# Altium project TTFT.PrjPCB
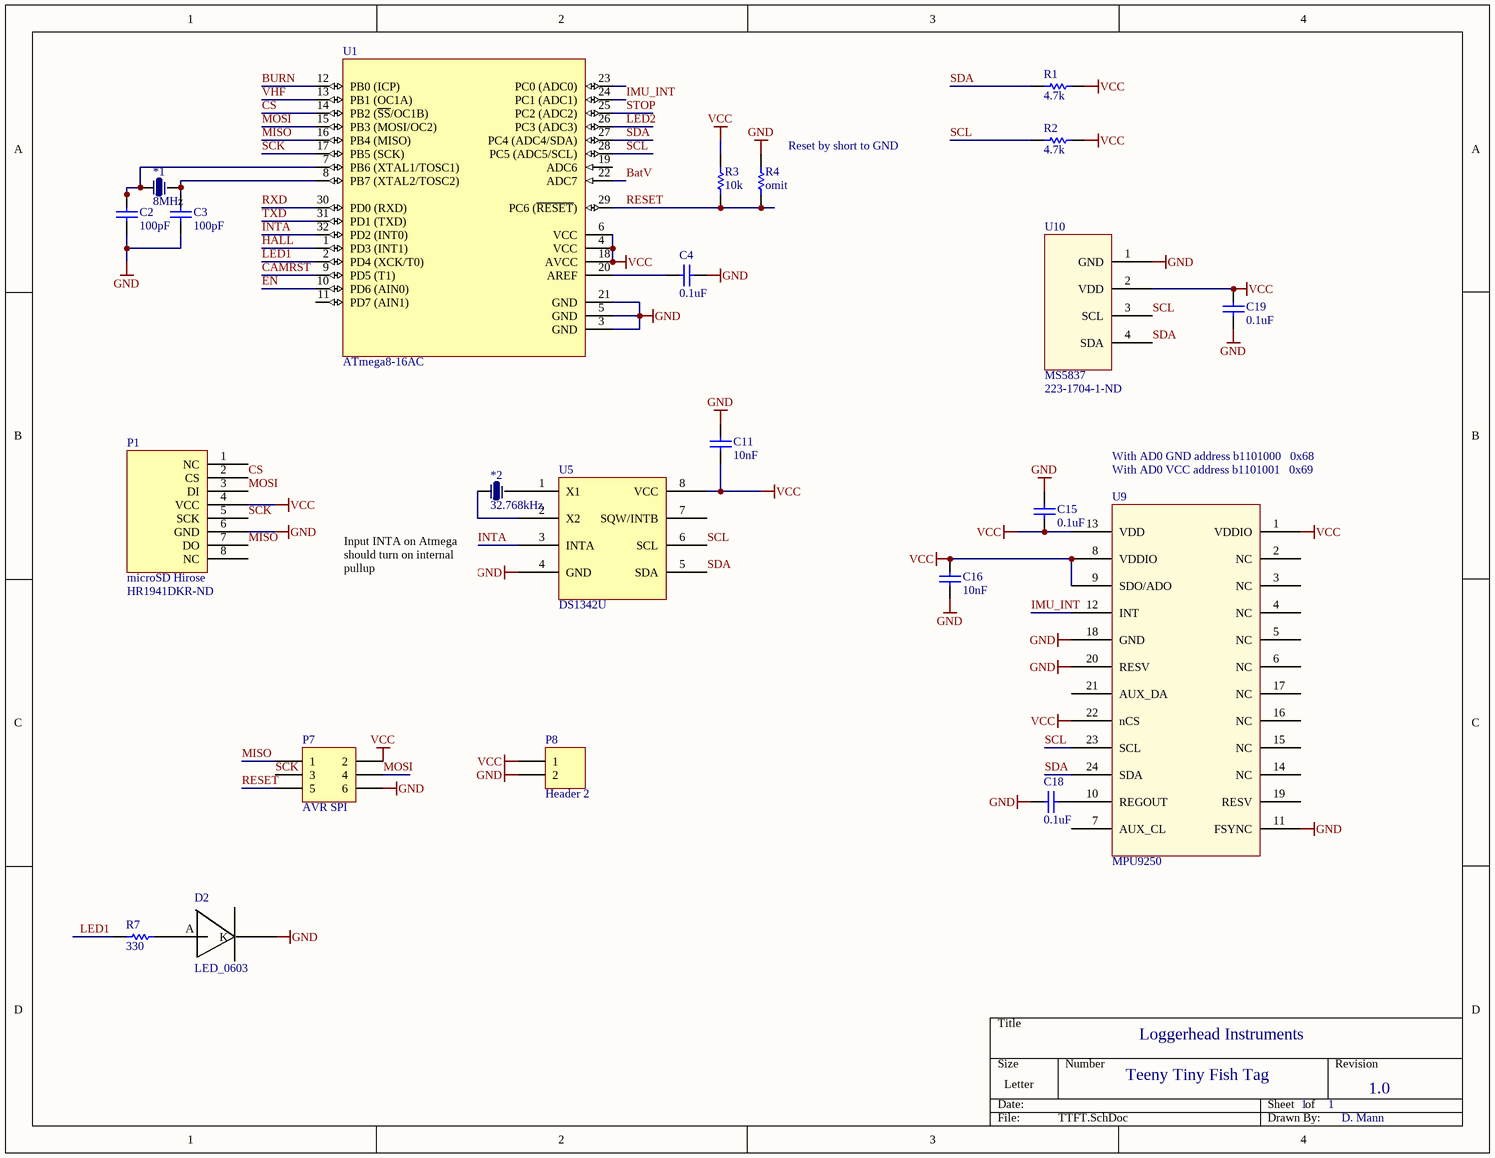
[diagram p0: TTFT.SchDoc]
1 sheet, 23 parts. Net scope: global (net labels, ports and power ports of the same name join across sheets).
Board file: TTFT.PcbDoc

## Sheet TTFT.SchDoc
size Letter

### Parts
*1  8MHz  [XTAL-ABM3]
*2  32.768kHz  [XTAL-ABS06]
C2  100pF  [0402]
C3  100pF  [0402]
C4  0.1uF  [0402]
C11  10nF  [0402]
C15  0.1uF  [0402]
C16  10nF  [0402]
C18  0.1uF  [0402]
C19  0.1uF  [0402]
D2  LED_0603  [Diode0603]
P1  microSD Hirose  Supplier Part Number 1: HR1941DKR-ND  [DM3D microSD]
P7  AVR SPI  [HDR2X3]
P8  Header 2  [HDR1X2]
R1  4.7k  [3-0603]
R2  4.7k  [3-0603]
R3  10k  [3-0603]
R4  omit  [3-0603]
R7  330  [3-0603]
U1  ATmega8-16AC  [32M1-A_M]
U5  DS1342U  [uSOP8]
U9  MPU9250  [MPU6500]
U10  MS5837  Supplier Part Number 1: 223-1704-1-ND  [MS5837]

### Nets
GND: C2.1 C3.1 C4.2 C11.1 C15.2 C16.2 C18.1 C19.1 D2.K P1.6(GND) P7.6 P8.2 R4.2 U1.3(GND) U1.5(GND) U1.21(GND) U5.4(GND) U9.11(FSYNC) U9.18(GND) U9.20(RESV) U10.1(GND)
VCC: C11.2 C15.1 C16.1 C19.2 P1.4(VCC) P7.2 P8.1 R1.2 R2.2 R3.2 U1.4(VCC) U1.6(VCC) U1.18(AVCC) U5.8(VCC) U9.1(VDDIO) U9.8(VDDIO) U9.9(SDO/ADO) U9.13(VDD) U9.22(nCS) U10.2(VDD)
BatV: U1.22(ADC7)
BURN: U1.12(PB0_(ICP))
CAMRST: U1.9(PD5_(T1))
CS: P1.2(CS) U1.14(PB2_(~{SS}/OC1B))
EN: U1.10(PD6_(AIN0))
HALL: U1.1(PD3_(INT1))
IMU_INT: U1.24(PC1_(ADC1)) U9.12(INT)
INTA: U1.32(PD2_(INT0)) U5.3(INTA)
LED1: R7.1 U1.2(PD4_(XCK/T0))
LED2: U1.26(PC3_(ADC3))
MISO: P1.7(DO) P7.1 U1.16(PB4_(MISO))
MOSI: P1.3(DI) P7.4 U1.15(PB3_(MOSI/OC2))
RESET: P7.5 R3.1 R4.1 U1.29(PC6_(~{RESET}))
RXD: U1.30(PD0_(RXD))
SCK: P1.5(SCK) P7.3 U1.17(PB5_(SCK))
SCL: R2.1 U1.28(PC5_(ADC5/SCL)) U5.6(SCL) U9.23(SCL) U10.3(SCL)
SDA: R1.1 U1.27(PC4_(ADC4/SDA)) U5.5(SDA) U9.24(SDA) U10.4(SDA)
STOP: U1.25(PC2_(ADC2))
TXD: U1.31(PD1_(TXD))
VHF: U1.13(PB1_(OC1A))
Net*1_1: *1.1 C2.2 U1.7(PB6_(XTAL1/TOSC1))
Net*1_2: *1.2 C3.2 U1.8(PB7_(XTAL2/TOSC2))
Net*2_1: *2.1 U5.2(X2)
Net*2_2: *2.2 U5.1(X1)
NetC4_1: C4.1 U1.20(AREF)
NetC18_2: C18.2 U9.10(REGOUT)
NetD2_A: D2.A R7.2

Not connected (* = marked no-connect by the designer): P1 1(NC) 8(NC); U1 11(PD7_(AIN1)) 19(ADC6) 23(PC0_(ADC0)); U5 7(SQW/INTB); U9 2(NC) 3(NC) 4(NC) 5(NC) 6(NC) 7(AUX_CL) 14(NC) 15(NC) 16(NC) 17(NC) 19(RESV) 21(AUX_DA)

### Notes on the sheet
- (near R4) Reset by short to GND
- With AD0 GND address b1101000   0x68
- With AD0 VCC address b1101001   0x69
- (near *2) Input INTA on Atmega should turn on internal pullup
- Loggerhead Instruments
- Teeny Tiny Fish Tag
- 1
- 1.0
- D. Mann

### Library data of the parts
*1 = XTAL-ABM3
*2 = XTAL_ABS06
C2-C4 C11 C15 C16 C18 C19 = C0402: Ceramic Chip Capacitor - Standard; Note: Footprint corresponds to dimensions for bulk cassette packaging. This case size has tightened tolerances.; Published: 17-Jul-2002; LatestRevisionDate: 19-Mar-2004; LatestRevisionNote: Silkscreen size reduced.; DatasheetDocument: Mar-2001; PackageDocument: Mar-2001; PackageReference: 0402; Publisher: Altium Limited; Code_JEITA: 0402; Code_IPC: 1005 [0402]; ComponentLink1Description: Manufacturer Link; ComponentLink1URL: http://www.kemet.com/; ComponentLink2Description: Datasheet; ComponentLink2URL: http://www.kemet.com/kemet/web/homepage/kechome.nsf/vapubfilesname/F3102TA.pdf/$file/F3102TA.pdf
  C2 C3: Value: 100pF
  C4 C15 C18 C19: Value: 0.1uF
  C11 C16: Value: 10nF
P7 = Header 3X2: Header, 3-Pin, Dual row; LatestRevisionDate: 17-Jul-2002; LatestRevisionNote: Re-released for DXP Platform.; Publisher: Altium Limited
P8 = Header 2: Header, 2-Pin; LatestRevisionDate: 17-Jul-2002; LatestRevisionNote: Re-released for DXP Platform.; Publisher: Altium Limited
R1-R4 R7 = ERJ3RK: Precision Thick Film Chip Resistor, 10 Ohm to 1M Ohm Range, 1% and 0.5% Tolerance, 0603 Size, 0.063 W; Published: 17-Dec-2003; LatestRevisionDate: 19-Mar-2004; LatestRevisionNote: Silkscreen size reduced.; PackageDocument: Mar-2003; PackageReference: 3-0603; Publisher: Altium Limited; Code_IPC: 1608 [0603]; ComponentLink1Description: Manufacturer Link; ComponentLink1URL: http://www.panasonic.com/industrial/components/resistive_products.htm; ComponentLink2Description: Datasheet; ComponentLink2URL: http://www.panasonic.com/industrial/components/pdf/AOA0000CE2.pdf
U1 = ATmega8-16AC: 8-Bit AVR Microcontroller with 8K Bytes of In-System Programmable Flash Memory; Published: 17-Sep-2003; LatestRevisionDate: 13-Apr-2006; LatestRevisionNote: IPC-7351 Footprint Added.; DatasheetVersion: 2486H-AVR-09/02; PackageVersion: revB, Oct-2001; PackageReference: 32A; Publisher: Altium Limited; PackageDescription: 32-Pin Thin Quad Flat Pack 0.8 mm Pitch; Code_JEDEC: MS-026-ABA; ComponentLink1Description: Manufacturer Link; ComponentLink1URL: http://www.atmel.com; ComponentLink2Description: Datasheet; ComponentLink2URL: http://www.atmel.com/dyn/resources/prod_documents/doc2486.pdf
U5 = DS1337
U9 = MPU-9250: Invensense
U10 = MS5837: Pressure/Temp; Supplier 1: Digi-Key
P1 = microSD Hirose: Supplier 1: Digi-Key